# Altium project Test_git.PrjPCB
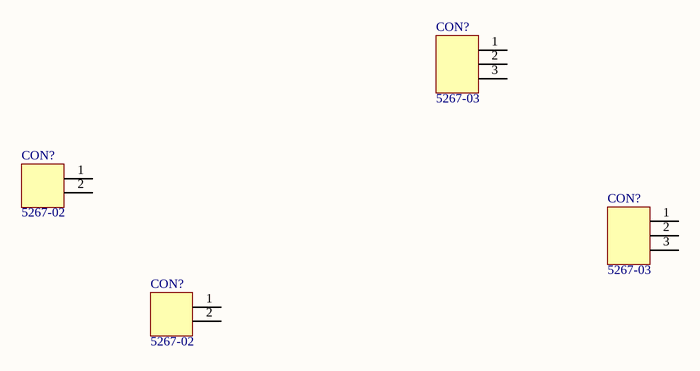
[diagram p0: Test_git.SchDoc]
1 sheet, 4 parts. Net scope: global (net labels, ports and power ports of the same name join across sheets).
Board file: Test_git.PcbDoc

## Sheet Test_git.SchDoc
size A4

### Parts
(Parts that share a designator on the sheet are numbered #1, #2 ... from top to bottom, then left to right.)
CON?#1  5267-03  [CND-5267-03]
CON?#2  5267-02  [CND-5267-02]
CON?#3  5267-03  [CND-5267-03]
CON?#4  5267-02  [CND-5267-02]

### Nets

Not connected (* = marked no-connect by the designer): CON?#1 1 2 3; CON?#2 1 2; CON?#3 1 2 3; CON?#4 1 2

### Library data of the parts
CON?#1 CON?#3 = 5267-03: CND-Molex-2.5mm
CON?#2 CON?#4 = 5267-02: CND-Molex-2.5mm